# Altium schematic sheet Top_Level.SchDoc
size A4; Organization: Q-Tech Design; Address1: Da Nang City; Address2: Viet Nam; DocumentNumber: 1; SheetNumber: 1; SheetTotal: 7
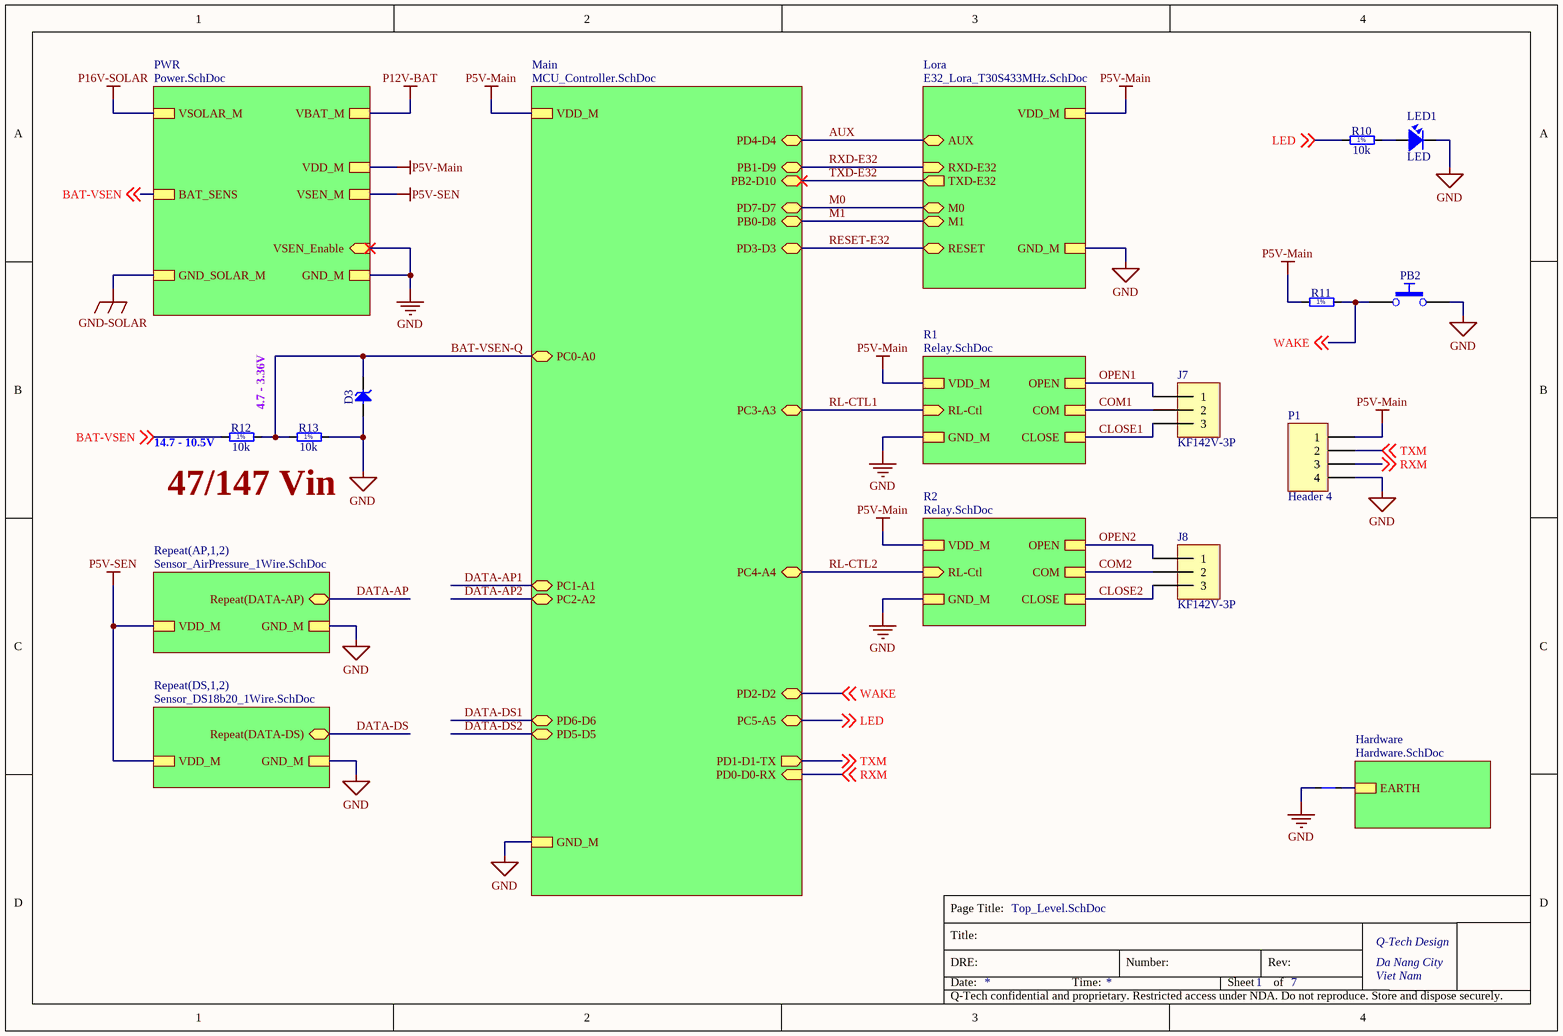
[diagram p0: Top_Level.SchDoc]

## Parts
D3  BZV55-B5V1  [DIOMELF3515N]  (value not drawn)
J7  KF142V-3P  [CON KF142V-3P-5.08]
J8  KF142V-3P  [CON KF142V-3P-5.08]
LED1  LED  [L-0805]
P1  Header 4  [HDR1X4]
PB2  Push Button  [PB_TYCO_FSMSM]  (value not drawn)
R10  10k  [RESC1608X55N]
R11  10k  [RESC1608X55N]  (value not drawn)
R12  10k  [RESC1608X55N]
R13  10k  [RESC1608X55N]
TIE1  TIE  [tie]  (value not drawn)

## Sub-sheets
Hardware = Hardware.SchDoc: EARTH
Lora = E32_Lora_T30S433MHz.SchDoc: M0 (bidir), M1 (bidir), RESET (bidir), AUX (bidir), GND_M, VDD_M, RXD-E32 (in), TXD-E32 (out)
Main = MCU_Controller.SchDoc: PB1-D9 (bidir), PB2-D10 (bidir), GND_M, PC3-A3 (bidir), PB0-D8 (bidir), PD6-D6 (bidir), PD2-D2 (bidir), PC4-A4 (bidir), PD4-D4 (bidir), PC5-A5 (bidir), PC2-A2 (bidir), PD0-D0-RX (in), PD3-D3 (bidir), PC1-A1 (bidir), PD7-D7 (bidir), VDD_M, PD5-D5 (bidir), PC0-A0 (bidir), PD1-D1-TX (out)
PWR = Power.SchDoc: VSOLAR_M, VSEN_Enable (in), BAT_SENS, VSEN_M, GND_SOLAR_M, VBAT_M, GND_M, VDD_M
R1 = Relay.SchDoc: OPEN, GND_M, CLOSE, RL-Ctl (in), VDD_M, COM
R2 = Relay.SchDoc: OPEN, GND_M, CLOSE, RL-Ctl (in), VDD_M, COM
Repeat(AP,1,2) = Sensor_AirPressure_1Wire.SchDoc: VDD_M, GND_M, Repeat(DATA-AP) (bidir)
Repeat(DS,1,2) = Sensor_DS18b20_1Wire.SchDoc: GND_M, Repeat(DATA-DS) (bidir), VDD_M

## Nets
GND: D3.2(A) LED1.2 P1.4 PB2.2 R13.2 TIE1.1 ; sheet Main/GND_M, sheet Lora/GND_M, sheet PWR/VSEN_Enable, sheet PWR/GND_M, sheet Repeat(AP,1,2)/GND_M, sheet Repeat(DS,1,2)/GND_M, sheet R1/GND_M, sheet R2/GND_M
GND-SOLAR: sheet PWR/GND_SOLAR_M
P5V-Main: P1.1 R11.1 ; sheet Main/VDD_M, sheet Lora/VDD_M, sheet PWR/VDD_M, sheet R1/VDD_M, sheet R2/VDD_M
P5V-SEN: sheet PWR/VSEN_M, sheet Repeat(AP,1,2)/VDD_M, sheet Repeat(DS,1,2)/VDD_M
P12V-BAT: sheet PWR/VBAT_M
P16V-SOLAR: sheet PWR/VSOLAR_M
AUX: sheet Main/PD4-D4, sheet Lora/AUX
BAT-VSEN: R12.1 ; off-sheet BAT-VSEN, sheet PWR/BAT_SENS
BAT-VSEN-Q: D3.1(C) R12.2 R13.1 ; sheet Main/PC0-A0
CLOSE1: J7.3 ; sheet R1/CLOSE
CLOSE2: J8.3 ; sheet R2/CLOSE
COM1: J7.2 ; sheet R1/COM
COM2: J8.2 ; sheet R2/COM
DATA-AP: sheet Repeat(AP,1,2)/Repeat(DATA-AP)
DATA-AP1: sheet Main/PC1-A1
DATA-AP2: sheet Main/PC2-A2
DATA-DS: sheet Repeat(DS,1,2)/Repeat(DATA-DS)
DATA-DS1: sheet Main/PD6-D6
DATA-DS2: sheet Main/PD5-D5
LED: R10.1 ; off-sheet LED, sheet Main/PC5-A5
M0: sheet Main/PD7-D7, sheet Lora/M0
M1: sheet Main/PB0-D8, sheet Lora/M1
OPEN1: J7.1 ; sheet R1/OPEN
OPEN2: J8.1 ; sheet R2/OPEN
RESET-E32: sheet Main/PD3-D3, sheet Lora/RESET
RL-CTL1: sheet Main/PC3-A3, sheet R1/RL-Ctl
RL-CTL2: sheet Main/PC4-A4, sheet R2/RL-Ctl
RXD-E32: sheet Main/PB1-D9, sheet Lora/RXD-E32
RXM: P1.3 ; off-sheet RXM, sheet Main/PD0-D0-RX
TXD-E32: sheet Main/PB2-D10, sheet Lora/TXD-E32
TXM: P1.2 ; off-sheet TXM, sheet Main/PD1-D1-TX
WAKE: PB2.1 R11.2 ; off-sheet WAKE, sheet Main/PD2-D2
NetLED1_1: LED1.1 R10.2
NetTIE1_2: TIE1.2 ; sheet Hardware/EARTH

## Notes on the sheet
- (near R12) 14.7 - 10.5V
- 4.7 - 3.36V
- 47/147 Vin
- Page Title:
- Date:
- Title:
- DRE:
- Time:
- Number:
- Sheet
- Rev:
- of
- Q-Tech confidential and proprietary. Restricted access under NDA. Do not reproduce. Store and dispose securely.
- (in symbol R0603_1M_1%_0.1W_100PPM) 1%
- (in symbol R0603_2M_1%_0.1W_100PPM) 1%
- (in symbol R0603_10K_1%_0.1W_100PPM) 1%
- (in symbol R0603_200R_1%_0.1W_100PPM) 1%

## Library data of the parts
D3 = BZV55-B5V1: Zener Diode; Part Description: Voltage Regulator Diode; Manufacturer: NXP SEMICONDUCTORS; Voltage: 5V1; Power: 500mW; Table: Diodes; Part Number: BZV55-B5V1; Component Kind: Standard; Component Type: Standard; Device: BZV55-B5V1; PackageDescription: SOD80C, MELF Diode, 2-Leads, Body 3.5x1.5mm, IPC Medium Density; Manufacturer Part Number: BZV55-B5V1; Pin Count: 2; Case: SOD-80C; Mounted: Yes; Socket: No; SMD: Yes; ComponentHeight: 1.6mm; HelpURL: \\cern.ch\dfs\Applications\Altium\Datasheets\BZV55.pdf; Author: CERN DEM JLC; CreateDate: 06-May-08; LatestRevisionDate: 06-May-08
J7 J8 = CON KF142V-3P-5.08
LED1 = LED: LED Single colour Green and Red; Value: LED 3 ly Single Colour
P1 = Header 4: Header, 4-Pin; LatestRevisionDate: 17-Jul-2002; LatestRevisionNote: Re-released for DXP Platform.; Publisher: Altium Limited
PB2 = PB SPST 1NO-2NO: Push-Button Switch SPDT; Part Description: 12VDC 50mA SPST Tactile  Push-Button Switch; Manufacturer: TYCO ELECTRONICS; Manufacturer Part Number: FSMSM or 1437566-3; Table: Switches; Part Number: PB_TYCO_FSMSM; Component Kind: Standard; Component Type: Standard; Pin Count: 2; PackageDescription: Body 3.5x6.0mm, Pushbutton Switch,  TYCO ALCOSWITCH FSMSM Serie; Family: Push Button; Mounted: Yes; Socket: No; SMD: Yes; Status: None; ComponentHeight: 4.3mm; HelpURL: \\cern.ch\dfs\Applications\Altium\Datasheets\PB_TYCO_FSMSM.pdf; Author: CERN DEM JLC; CreateDate: 6/30/2008; LatestRevisionDate: 6/21/2012
R10 = R0603_200R_1%_0.1W_100PPM: Resistor - 1%; Part Description: General Purpose Thick Film Chip Resistor; Manufacturer: GENERIC; Manufacturer1 Part Number: NRC06F2000TRF; Value: 200; Power: 0.1W; TC: ±100ppm/°C; Table: Resistors SMD; Part Number: R0603_200R_1%_0.1W_100PPM; Component Kind: Standard; Component Type: Standard; Pin Count: 2; Status: Preferred; Tolerance: ±1%; Manufacturer Part Number: R0603_200R_1%_0.1W_100PPM; Case: 0603; Mounted: Yes; Socket: No; SMD: Yes; Manufacturer1 Example: NIC COMPONENT; Manufacturer1 ComponentHeight: 0.55mm; HelpURL: \\cern.ch\dfs\Applications\Altium\Datasheets\R0603_NIC_NRC.pdf; Author: CERN DEM JLC; CreateDate: 03-Dec-07; LatestRevisionDate: 13-Mar-08
R11 = R0603_10K_1%_0.1W_100PPM: Resistor - 1%; Part Description: General Purpose Thick Film Chip Resistor; Manufacturer: GENERIC; Manufacturer1 Part Number: NRC06F1002TRF; Power: 0.1W; TC: ±100ppm/°C; Table: Resistors SMD; Part Number: R0603_10K_1%_0.1W_100PPM; Component Kind: Standard; Component Type: Standard; Pin Count: 2; Value: 10k; Status: Preferred; Tolerance: ±1%; Manufacturer Part Number: R0603_10K_1%_0.1W_100PPM; Case: 0603; Mounted: Yes; Socket: No; SMD: Yes; Manufacturer1 Example: NIC COMPONENT; Manufacturer1 ComponentHeight: 0.55mm; HelpURL: \\cern.ch\dfs\Applications\Altium\Datasheets\R0603_NIC_NRC.pdf; Author: CERN DEM JLC; CreateDate: 03-Dec-07; LatestRevisionDate: 13-Mar-08
R12 = R0603_2M_1%_0.1W_100PPM: Resistor - 1%; Part Description: General Purpose Thick Film Chip Resistor; Manufacturer: GENERIC; Manufacturer1 Part Number: NRC06F2004TRF; Value: 2M; Power: 0.1W; TC: ±100ppm/°C; Table: Resistors SMD; Part Number: R0603_2M_1%_0.1W_100PPM; Component Kind: Standard; Component Type: Standard; Pin Count: 2; Status: Preferred; Tolerance: ±1%; Manufacturer Part Number: R0603_2M_1%_0.1W_100PPM; Case: 0603; Mounted: Yes; Socket: No; SMD: Yes; Manufacturer1 Example: NIC COMPONENT; Manufacturer1 ComponentHeight: 0.55mm; HelpURL: \\cern.ch\dfs\Applications\Altium\Datasheets\R0603_NIC_NRC.pdf; Author: CERN DEM JLC; CreateDate: 03-Dec-07; LatestRevisionDate: 13-Mar-08
R13 = R0603_1M_1%_0.1W_100PPM: Resistor - 1%; Part Description: General Purpose Thick Film Chip Resistor; Manufacturer: GENERIC; Manufacturer1 Part Number: NRC06F1004TRF; Value: 1M; Power: 0.1W; TC: ±100ppm/°C; Table: Resistors SMD; Part Number: R0603_1M_1%_0.1W_100PPM; Component Kind: Standard; Component Type: Standard; Pin Count: 2; Status: Preferred; Tolerance: ±1%; Manufacturer Part Number: R0603_1M_1%_0.1W_100PPM; Case: 0603; Mounted: Yes; Socket: No; SMD: Yes; Manufacturer1 Example: NIC COMPONENT; Manufacturer1 ComponentHeight: 0.55mm; HelpURL: \\cern.ch\dfs\Applications\Altium\Datasheets\R0603_NIC_NRC.pdf; Author: CERN DEM JLC; CreateDate: 03-Dec-07; LatestRevisionDate: 13-Mar-08